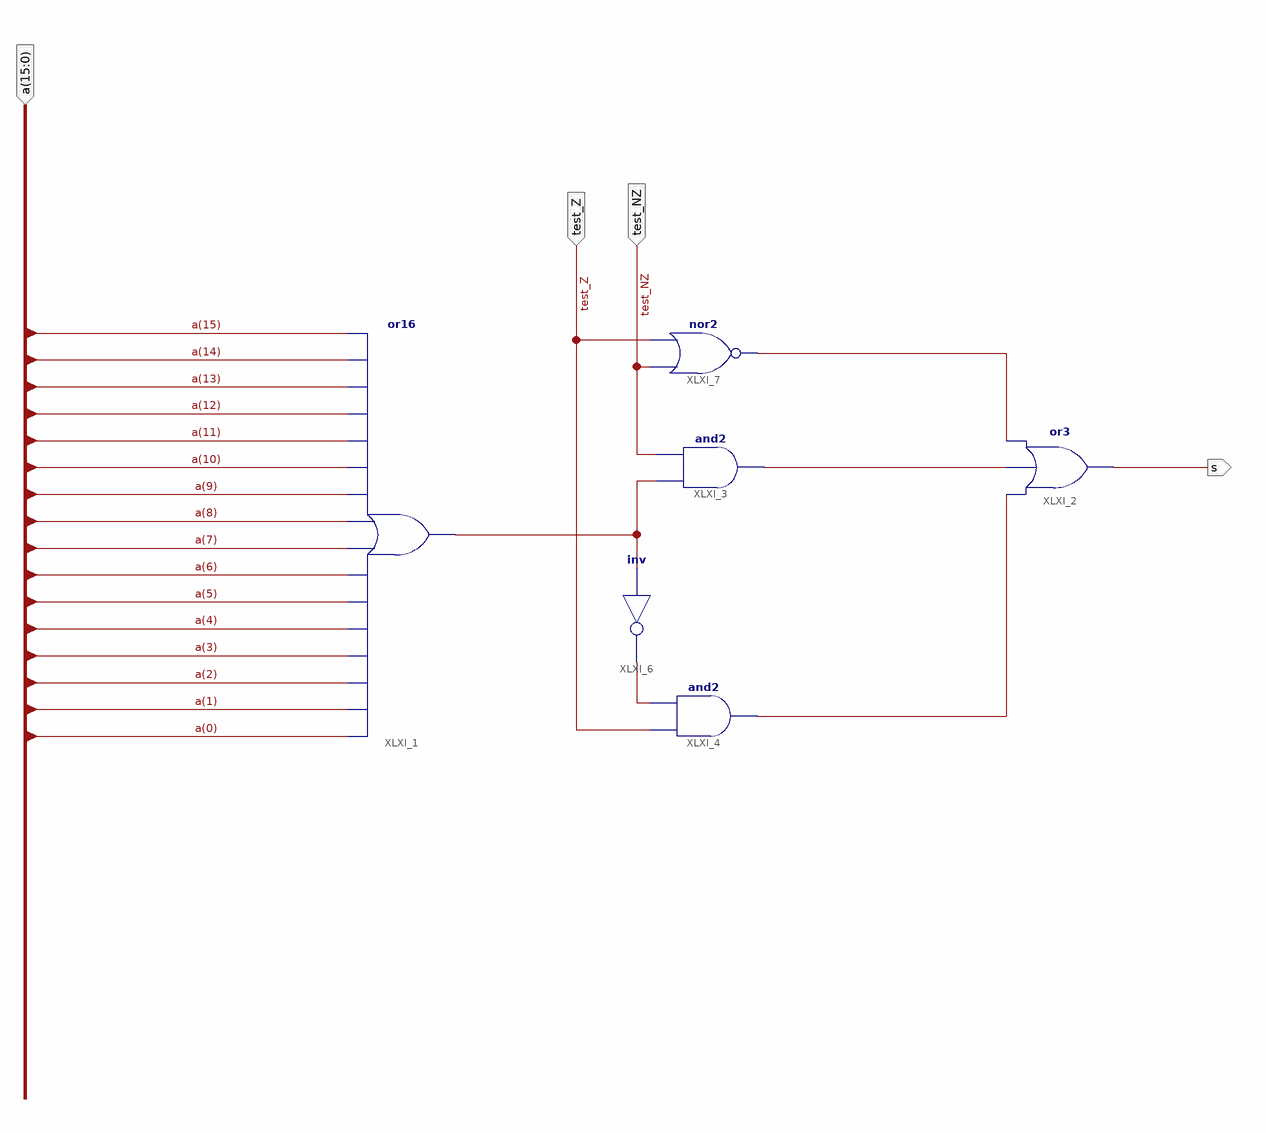
[diagram p0: schematic sheet 1]
// Xilinx ISE schematic testeur.sch (spartan3e) as structural Verilog: 6 symbols, 4 ports
module testeur (
  input  [15:0] a,
  input  test_NZ,
  input  test_Z,
  output s
);

  wire XLXN_2, XLXN_3, XLXN_5, XLXN_6, XLXN_7;

  or XLXI_1 (XLXN_3, a[0], a[1], a[2], a[3], a[4], a[5], a[6], a[7], a[8], a[9], a[10], a[11], a[12], a[13], a[14], a[15]);
  or XLXI_2 (s, XLXN_6, XLXN_5, XLXN_7);
  and XLXI_3 (XLXN_5, XLXN_3, test_NZ);
  and XLXI_4 (XLXN_6, test_Z, XLXN_2);
  not XLXI_6 (XLXN_2, XLXN_3);
  nor XLXI_7 (XLXN_7, test_NZ, test_Z);
endmodule
